# Altium schematic sheet Keyfinder_Alert.SchDoc: Keyfinder Alert
size A4; DrawnBy: M. Schwegler; Organization: HSLU T&A; Address1: Abteilung Elektrotechnik; Address2: Technikumsstrasse 21; Address3: CH-6048 Horw; Revision: v1; SheetNumber: 4; SheetTotal: 4; Projektname: SmartBoard; DocumentName: Keyfinder; ProjectName: SmartBoard
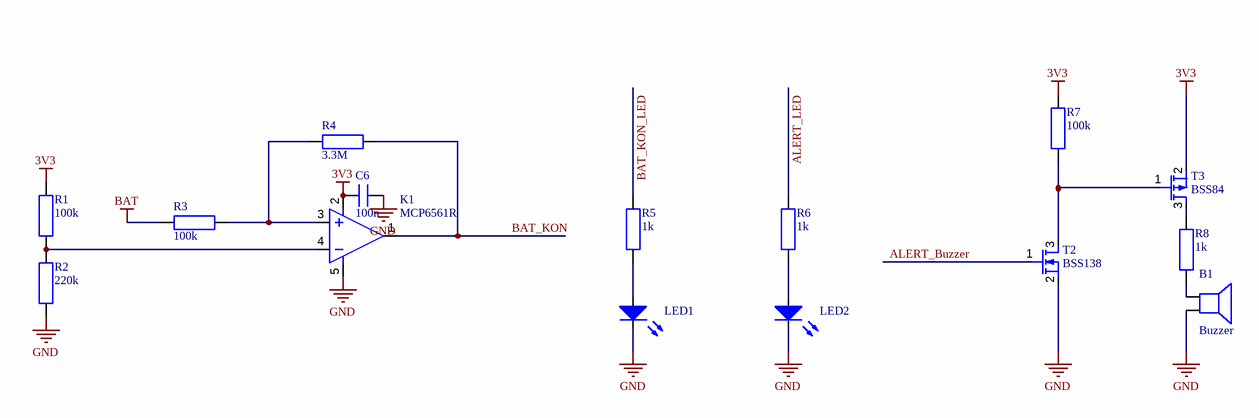
[diagram p0: Keyfinder_Alert.SchDoc]

## Parts
B1  Buzzer  [piezo_ele]
C6  100n  [0805_C]
K1  MCP6561R  [SOT23-5]
LED1  (no value)  [0805_LED]
LED2  (no value)  [0805_LED]
R1  100k  [0805_R]
R2  220k  [0805_R]
R3  100k  [0805_R]
R4  3.3M  [0805_R]
R5  1k  [0805_R]
R6  1k  [0805_R]
R7  100k  [0805_R]
R8  1k  [0805_R]
T2  BSS138  [SOT23-3]
T3  BSS84  [SOT23-3]

## Nets
3V3: C6.2 K1.2 R1.1 R7.1 T3.2(S)
BAT: R3.2
GND: B1.2 C6.1 K1.5 LED1.2(K) LED2.2(K) R2.2 T2.2(S)
ALERT_Buzzer: T2.1(G)
ALERT_LED: R6.1
BAT_KON: K1.1 R4.1
BAT_KON_LED: R5.1
NetB1_1: B1.1 R8.2
NetK1_3: K1.3 R3.1 R4.2
NetK1_4: K1.4 R1.2 R2.1
NetLED1_1: LED1.1(A) R5.2
NetLED2_1: LED2.1(A) R6.2
NetR7_2: R7.2 T2.3(D) T3.1(G)
NetR8_1: R8.1 T3.3(D)

## Notes on the sheet
- Project:
- Drawn by:
- Size:
- Sheet
- A4
- Rev.:
- of
- Date:
- File:

## Library data of the parts
B1 = SPEAKER
C6 = C?: Normaler Kondensator
K1 = OPAMP
LED1 LED2 = LED
R1-R8 = R?: Normaler Widerstand
T2 = MOSFET-N 1D,2G,3S: Remark: *
T3 = MOSFET-P 1D,2G,3S